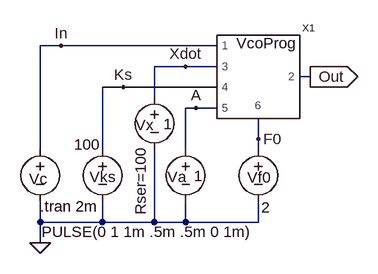
[diagram p0: schematic VcoJer.asc]
VcoJer.asc, the LTspice schematic file:
Version 4
SHEET 1 880 680
WIRE -304 304 -304 144
WIRE -304 416 -304 384
WIRE -304 448 -304 416
WIRE -272 144 -304 144
WIRE -208 304 -208 208
WIRE -208 416 -304 416
WIRE -208 416 -208 384
WIRE -176 208 -208 208
WIRE -128 224 -128 176
WIRE -128 416 -208 416
WIRE -128 416 -128 304
WIRE -80 176 -128 176
WIRE -80 304 -80 240
WIRE -80 416 -128 416
WIRE -80 416 -80 384
WIRE -64 240 -80 240
WIRE -32 144 -272 144
WIRE -32 176 -80 176
WIRE -32 208 -176 208
WIRE -32 240 -64 240
WIRE 32 288 32 256
WIRE 32 304 32 288
WIRE 32 416 -80 416
WIRE 32 416 32 384
WIRE 112 192 96 192
FLAG -304 448 0
FLAG 112 192 Out
IOPIN 112 192 Out
FLAG -272 144 In
FLAG -176 208 Ks
FLAG -80 176 Xdot
FLAG -64 240 A
FLAG 32 288 F0
SYMBOL voltage -304 288 R0
WINDOW 0 -17 61 Left 0
WINDOW 123 0 0 Left 0
WINDOW 39 0 0 Left 0
WINDOW 3 326 143 Right 0
SYMATTR InstName Vc
SYMATTR Value PULSE(0 1 1m .5m .5m 0 1m)
SYMBOL voltage -208 288 R0
WINDOW 0 -20 58 Left 0
WINDOW 123 0 0 Left 0
WINDOW 39 0 0 Left 0
WINDOW 3 -44 8 Left 0
SYMATTR InstName Vks
SYMATTR Value 100
SYMBOL voltage 32 288 R0
WINDOW 0 -17 59 Left 0
WINDOW 123 0 0 Left 0
WINDOW 39 0 0 Left 0
WINDOW 3 5 105 Left 0
SYMATTR InstName Vf0
SYMATTR Value 2
SYMBOL voltage -80 288 R0
WINDOW 0 -28 58 Left 0
WINDOW 123 0 0 Left 0
WINDOW 39 0 0 Left 0
WINDOW 3 13 57 Left 0
SYMATTR InstName Va
SYMATTR Value 1
SYMBOL voltage -128 208 R0
WINDOW 0 -29 58 Left 0
WINDOW 3 14 57 Left 0
WINDOW 123 0 0 Left 0
WINDOW 39 -21 91 VRight 0
SYMATTR InstName Vx
SYMATTR Value 1
SYMATTR SpiceLine Rser=100
SYMBOL vcoprog 32 192 R0
SYMATTR InstName X1
TEXT -304 392 Left 0 !.tran 2m

The netlist it stands for:
* VcoJer.asc
Vc In 0 PULSE(0 1 1m .5m .5m 0 1m)
Vks Ks 0 100
Vf0 F0 0 2
Va A 0 1
Vx Xdot 0 1 Rser=100
XX1 In Out Xdot Ks A F0 vcoprog params: VcoProg  ; pins 1 2 3 4 5 6
.tran 2m
.backanno
.end